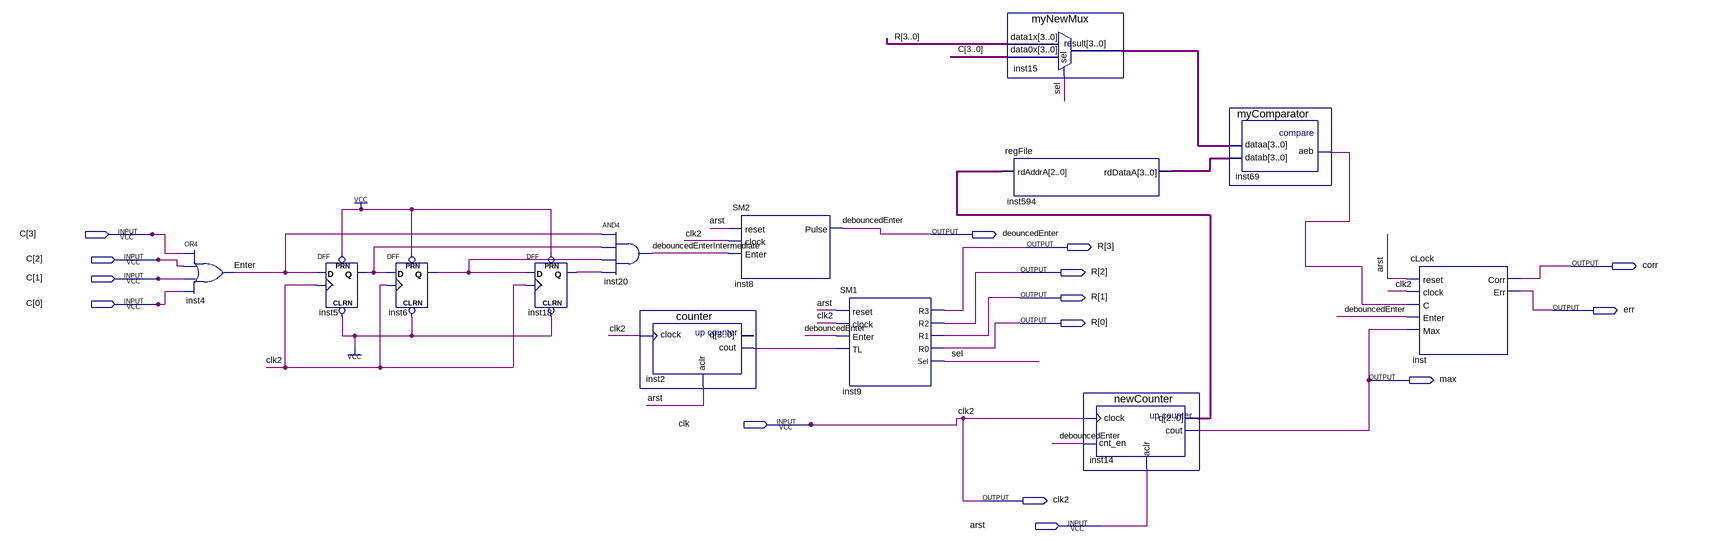
[diagram p0: schematic sheet]
// Quartus schematic tst.bdf as structural Verilog: 13 symbols, 15 pins
module tst (
  input  [3:0] C,
  input  clk,
  input  arst,
  output deouncedEnter,
  output [3:0] R,
  output corr,
  output err,
  output max,
  output clk2
);

  wire debouncedEnterIntermediate, Enter, inst2_cout, inst5_q, inst6_q, inst18_q, inst69_aeb, sel;
  wire [2:0] inst14_q;
  wire [3:0] inst15_result, inst594_rddataa;

  or inst4 (Enter, C[3], C[2], C[1], C[0]);
  DFF inst5 (.CLRN(1'b1), .CLK(clk), .D(Enter), .PRN(1'b1), .Q(inst5_q));
  DFF inst6 (.CLRN(1'b1), .CLK(clk), .D(inst5_q), .PRN(1'b1), .Q(inst6_q));
  DFF inst18 (.CLRN(1'b1), .CLK(clk), .D(inst6_q), .PRN(1'b1), .Q(inst18_q));
  and inst20 (debouncedEnterIntermediate, Enter, inst5_q, inst6_q, inst18_q);
  counter inst2 (.clock(clk), .aclr(arst), .cout(inst2_cout));  // open: q
  SM2 inst8 (.reset(arst), .clock(clk), .Enter(debouncedEnterIntermediate), .Pulse(deouncedEnter));
  SM1 inst9 (
    .reset(arst), .clock(clk), .Enter(deouncedEnter), .TL(inst2_cout), .R3(R[3]), .R2(R[2]), .R1(R[1]),
    .R0(R[0]), .Sel(sel));
  myNewMux inst15 (.data1x(R), .data0x(C), .sel(sel), .result(inst15_result));
  regFile inst594 (.rdAddrA(inst14_q), .rdDataA(inst594_rddataa));
  newCounter inst14 (.clock(clk), .cnt_en(deouncedEnter), .aclr(arst), .cout(max), .q(inst14_q));
  myComparator inst69 (.dataa(inst15_result), .datab(inst594_rddataa), .aeb(inst69_aeb));
  cLock inst (.reset(arst), .clock(clk), .C(inst69_aeb), .Enter(deouncedEnter), .Max(max), .Corr(corr), .Err(err));

  assign clk2 = clk;

  // Other names for the same wires on the sheet: debouncedEnter = deouncedEnter
endmodule
